# EAGLE design D (EAGLE 8.0.0)
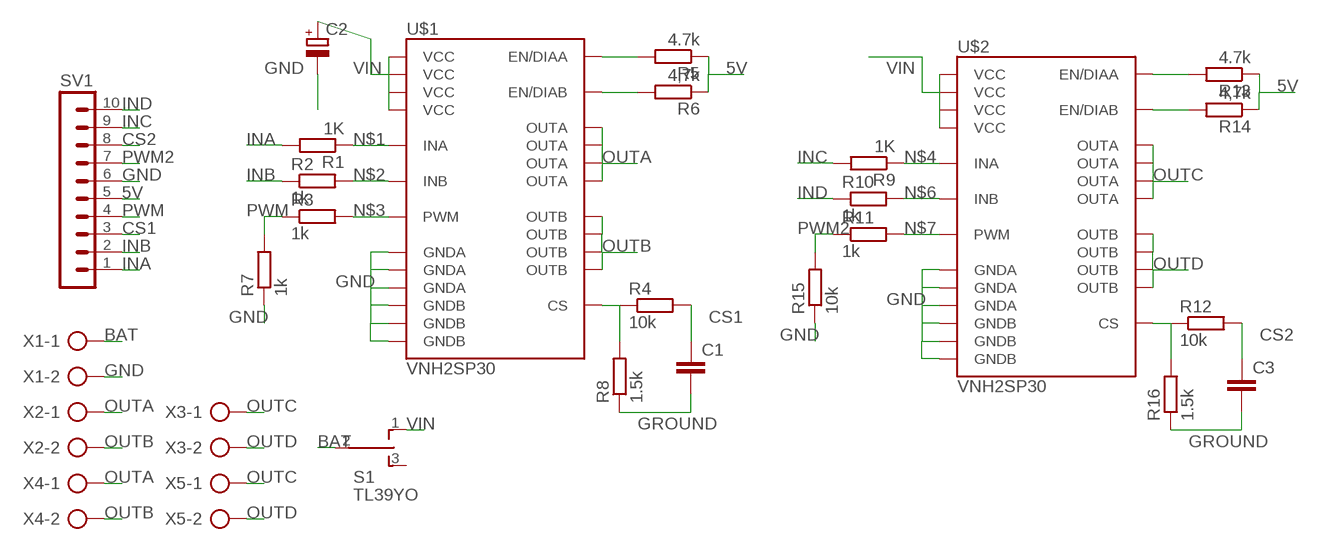
[diagram p0: schematic, sheet 1]

## Parts
C1  CAP1206  [1206]
C2  CPOL-EUE3.5-8  [E3,5-8]
C3  CAP1206  [1206]
R1  1K  R-EU_M1206  [M1206]
R2  1k  R-EU_M1206  [M1206]
R3  1k  R-EU_M1206  [M1206]
R4  10k  R-EU_M1206  [M1206]
R5  4.7k  R-EU_M1206  [M1206]
R6  4,7k  R-EU_M1206  [M1206]
R7  1k  R-EU_M1206  [M1206]
R8  1.5k  R-EU_M1206  [M1206]
R9  1K  R-EU_M1206  [M1206]
R10  1k  R-EU_M1206  [M1206]
R11  1k  R-EU_M1206  [M1206]
R12  10k  R-EU_M1206  [M1206]
R13  4.7k  R-EU_M1206  [M1206]
R14  4,7k  R-EU_M1206  [M1206]
R15  10k  R-EU_M1206  [M1206]
R16  1.5k  R-EU_M1206  [M1206]
S1  TL39YO  [TL3XYO]
SV1  MA10-1W  [MA10-1W]
U$1  VNH2SP30  [VNH2SP30]
U$2  VNH2SP30  [VNH2SP30]
X1  AK300/2  [AK300/2]
X2  AK300/2  [AK300/2]
X3  AK300/2  [AK300/2]
X4  AK300/2  [AK300/2]
X5  AK300/2  [AK300/2]

## Nets
5V: R5.1 R6.1 R13.1 R14.1 SV1.5
BAT: S1.2(P) X1.1
CS1: C1.1 R4.2 SV1.3
CS2: C3.1 R12.2 SV1.8
GND: C2.- R7.1 R15.1 SV1.6 U$1.18(GNDB) U$1.19(GNDB) U$1.20(GNDB) U$1.26(GNDA) U$1.27(GNDA) U$1.28(GNDA) U$2.18(GNDB) U$2.19(GNDB) U$2.20(GNDB) U$2.26(GNDA) U$2.27(GNDA) U$2.28(GNDA) X1.2
GROUND: C1.2 C3.2 R8.1 R16.1
HJ: R12.1 R16.2 U$2.9(CS)
INA: R1.2 SV1.1
INB: R2.1 SV1.2
INC: R9.2 SV1.9
IND: R10.1 SV1.10
N$1: R1.1 U$1.5(INA)
N$2: R2.2 U$1.11(INB)
N$3: R3.2 U$1.8(PWM)
N$4: R9.1 U$2.5(INA)
N$6: R10.2 U$2.11(INB)
N$7: R11.2 U$2.8(PWM)
N$9: R4.1 R8.2 U$1.9(CS)
N$10: R5.2 U$1.6(EN/DIAA)
N$11: R6.2 U$1.10(EN/DIAB)
N$12: R13.2 U$2.6(EN/DIAA)
N$13: R14.2 U$2.10(EN/DIAB)
OUTA: U$1.1(OUTA) U$1.25(OUTA) U$1.30(OUTA) U$1.SLUG3(OUTA) X2.1 X4.1
OUTB: U$1.15(OUTB) U$1.16(OUTB) U$1.21(OUTB) U$1.SLUG2(OUTB) X2.2 X4.2
OUTC: U$2.1(OUTA) U$2.25(OUTA) U$2.30(OUTA) U$2.SLUG3(OUTA) X3.1 X5.1
OUTD: U$2.15(OUTB) U$2.16(OUTB) U$2.21(OUTB) U$2.SLUG2(OUTB) X3.2 X5.2
PWM: R3.1 R7.2 SV1.4
PWM2: R11.1 R15.2 SV1.7
VIN: C2.+ S1.1(O) U$1.3(VCC) U$1.13(VCC) U$1.23(VCC) U$1.SLUG1(VCC) U$2.3(VCC) U$2.13(VCC) U$2.23(VCC) U$2.SLUG1(VCC)
Unconnected: S1.3(S)

## Library data of the parts
C1 C3 = SparkFun:CAP: Capacitor Standard 0603 ceramic capacitor, and 0.1" leaded capacitor.
C2 = rcl:CPOL-EU: POLARIZED CAPACITOR, European symbol
R1-R16 = rcl:R-EU_: RESISTOR, European symbol
S1 = switch:TL39YO: TINY SWITCH ON OFF ON Source: http://www2.produktinfo.conrad.com/datenblaetter/700000-724999/705152-da-01-de-Subminiaturschalter_TL_36YO.pdf
SV1 = con-lstb:MA10-1W: PIN HEADER; OC_FARNELL: unknown; OC_NEWARK: unknown
U$1 U$2 = SparkFun:VNH2SP30
X1-X5 = con-ptr500:AK300/2: CONNECTOR; OC_FARNELL: unknown; OC_NEWARK: unknown

## Board
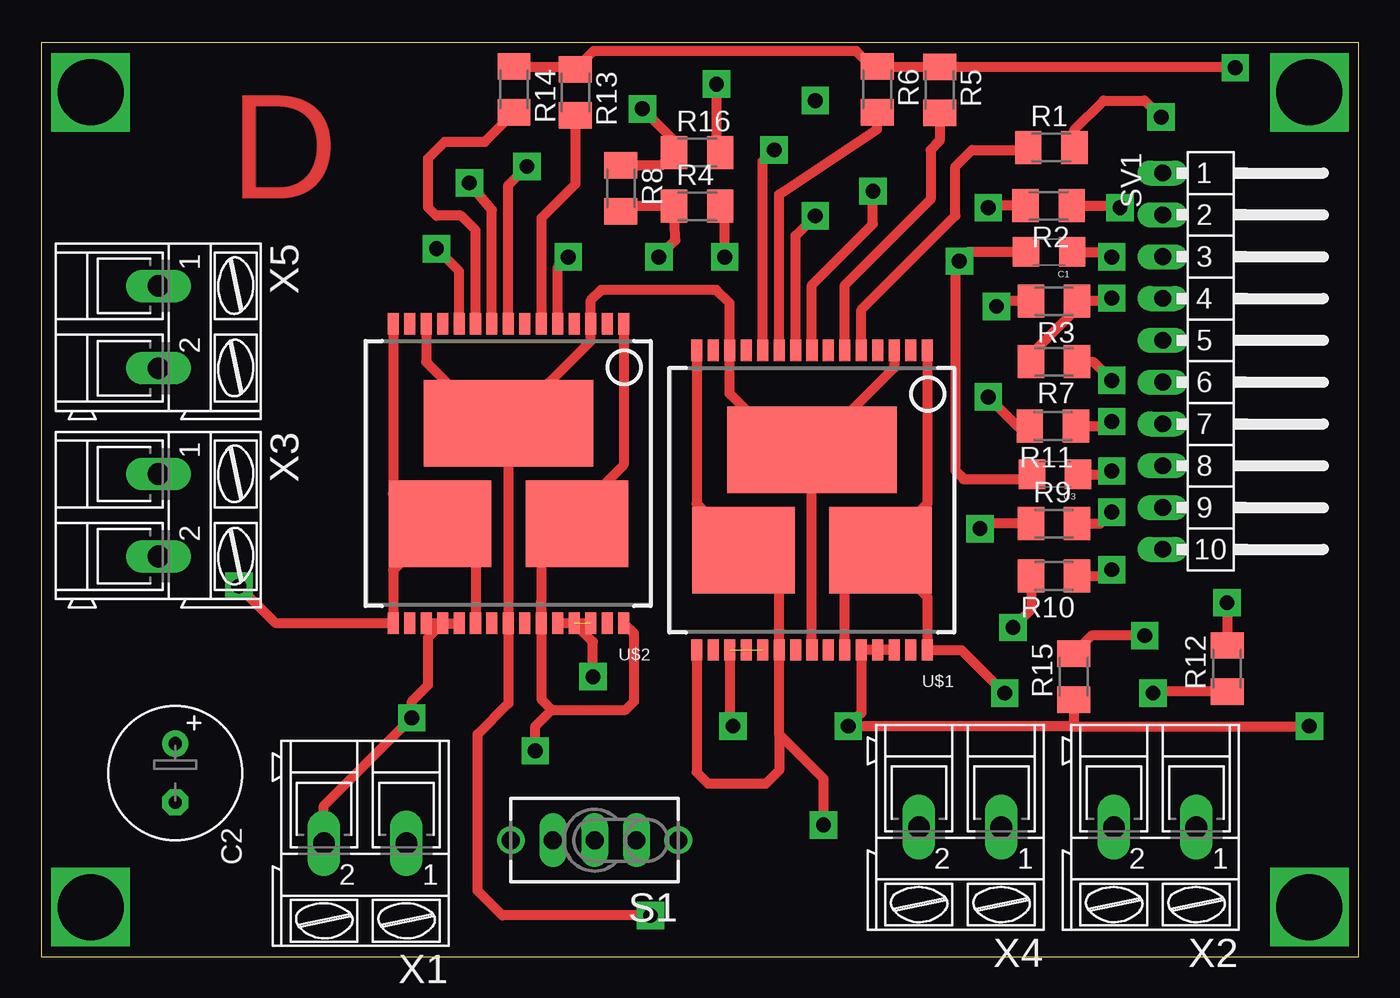
[diagram p1: board, top side]
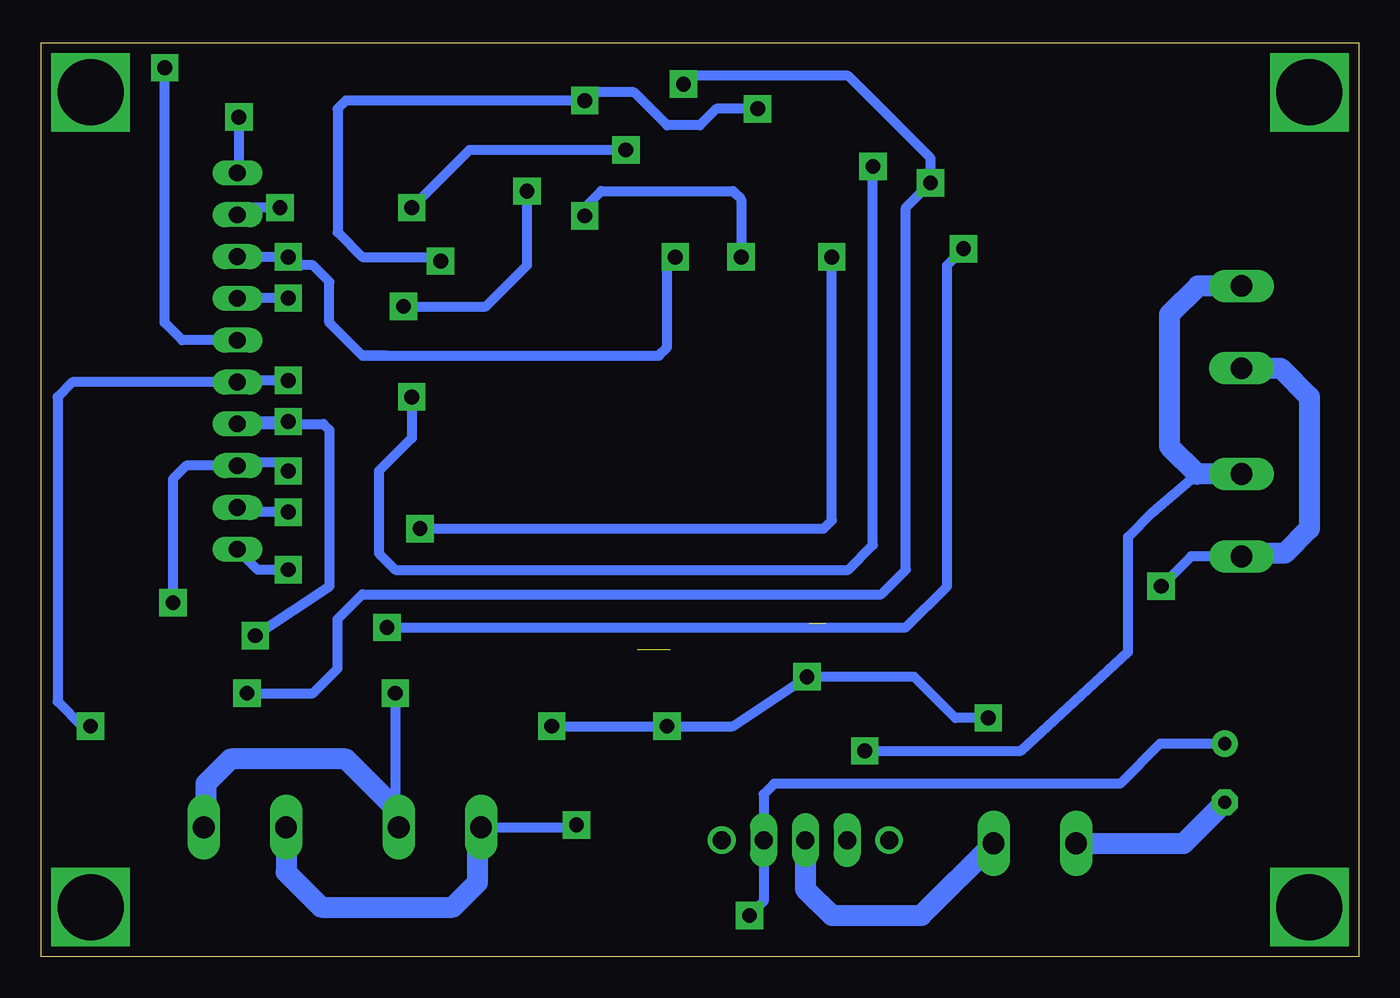
[diagram p2: board, bottom side, seen from below]

Size 80 x 55.5 mm. Coordinates in mm from the lower left corner, seen from the top.
Outline: 0,0 80,0 80,55.5 0,55.5 0,0
Copper layers (1*16): Top 0.035mm / dielectric 1.5mm / Bottom 0.035mm
Design rules "default *": minimum track width 15mil, minimum drill 24mil, track to track 8mil, track to pad 8mil, pad to pad 8mil, via to via 8mil, smd to smd 8mil, copper to edge 40mil, drill to drill 8mil, minimum pad ring 10mil, minimum via ring 15mil, stop-mask expansion 4mil, vias tented up to drill 0mil, thermal gap 10mil

### Footprints (pad centres in the part's own frame; a part is rotated, then mirrored left to right if it is on the bottom)
1206 = smd 1.6 x 1.8: 1 -1.4,0; 2 1.4,0
E3,5-8 = drill 0.813 pad 1.6: + -1.778,0 | drill 0.813 pad 1.6 octagon: - 1.778,0
M1206 = smd 1.6 x 2: 1 -1.4,0; 2 1.4,0
TL3XYO = drill 1.1 pad 1.422 long: 1 -2.54,0; 2 0,0; 3 2.54,0 | drill 1.1 pad 1.676: M1 -5.08,0; M2 5.08,0
MA10-1W = drill 1.016 long: 1 -11.43,0; 2 -8.89,0; 3 -6.35,0; 4 -3.81,0; 5 -1.27,0; 6 1.27,0; 7 3.81,0; 8 6.35,0; 9 8.89,0; 10 11.43,0
VNH2SP30 = smd 0.67 x 1.3: 1 -7,-9.1; 2 -6,-9.1; 3 -5,-9.1; 4 -4,-9.1; 5 -3,-9.1; 6 -2,-9.1; 7 -1,-9.1; 8 0,-9.1; 9 1,-9.1; 10 2,-9.1; 11 3,-9.1; 12 4,-9.1; 13 5,-9.1; 14 6,-9.1; 15 7,-9.1; 16 7,9.1; 17 6,9.1; 18 5,9.1; 19 4,9.1; 20 3,9.1; 21 2,9.1; 22 1,9.1; 23 0,9.1; 24 -1,9.1; 25 -2,9.1; 26 -3,9.1; 27 -4,9.1; 28 -5,9.1; 29 -6,9.1; 30 -7,9.1 | smd 10.3 x 5.25: SLUG1 0,-3.05 | smd 6.23 x 5.25: SLUG2 4.165,3.05; SLUG3 -4.165,3.05
AK300/2 = drill 1.321 long: 1 -2.515,0; 2 2.489,0

### Placement (x,y rotation side)
C1  61.2,42.8 180 top
C2  8.14,11.15 270 top
C3  61.55,29.3 180 top
R1  61.33,49.15 0 top
R2  61.17,45.61 180 top
R3  61.5,39.81 180 top
R4  39.83,45.58 0 top
R5  54.55,52.64 270 top
R6  50.76,52.67 270 top
R7  61.5,36.13 180 top
R8  35.2,46.67 270 top
R9  61.5,26.3 0 top
R10  61.5,23.12 180 top
R11  61.42,32.23 180 top
R12  72,17.5 90 top
R13  32.43,52.5 270 top
R14  28.71,52.67 270 top
R15  62.69,17 90 top
R16  39.83,48.84 0 top
S1  33.6,7.07 180 top
SV1  68.09,36.17 270 top
U$1  46.8,27.73 180 top
U$2  28.37,29.35 180 top
X1  19.66,6.88 180 top
X2  67.62,7.86 180 top
X3  7.12,26.8 270 top
X4  55.78,7.86 180 top
X5  7.12,38.23 270 top

### Tracks (layer width: path | path; a pad name or v marks a point on that pad's centre or on a via)
5V  (via drill 0.9)
  Top 0.61: 50.59,53.9 R6.1 | R6.1 50.79,54.04 R5.1 72.46,54.04 v72.5,54 | R14.1 32.26,54.07 R13.1 33.53,55 49.5,55 50.43,54.07 R6.1
  Bottom 0.61: v72.5,54 72.5,38.5 71.44,37.44 SV1.5
BAT
  Bottom 1.27: S1.2 33.6,4.1 32,2.5 26.55,2.5 X1.1
CS1  (via drill 0.9)
  Top 0.61: C1.1 64.7,42.8 v65,42.5 | v41.5,42.5 41.5,45.31 R4.2
  Bottom 0.61: 68.02,42.52 SV1.3 68.07,42.5 v65,42.5 64.5,42 63.5,42 62.5,41 62.5,38.5 60.5,36.5 | 60.5,36.5 59,36.5 | 59,36.5 42.5,36.5 42,37 42,42 v41.5,42.5 | 59,36.5 60.5,36.5
CS2  (via drill 0.9)
  Top 0.61: C3.1 64.8,29.3 v65,29.5 | v72,21.5 R12.2
  Bottom 0.61: v65,29.5 65.5,30 67.91,30 SV1.8 71.18,29.82 72,29 v72,21.5
GND  (via drill 0.9)  (3 unrouted)
  Top 0.61: U$2.19 U$2.18 | U$2.19 U$2.20 | v33.5,17 33.5,19.12 U$2.27 | U$2.28 U$2.26 | X1.2 17.17,9.17 v22.5,14.5 22.5,15.5 23.5,16.5 23.5,19.38 U$2.19 | U$1.18 41.8,14.8 v42,14 | U$1.28 U$1.27 U$1.26 49.8,14.8 v49,14 62.5,14 | 62.5,14 v77,14 | R15.1 62.69,14.19 62.5,14 | R7.1 63.87,36.13 v65,35
  Bottom 0.61: v22.5,14.5 24.5,14.5 27,17 v33.5,17 38,14 v42,14 v49,14 | v77,14 77.5,14 79,15.5 79,34 78.1,34.9 SV1.6 67.99,35 v65,35
  Bottom 1.27: X1.2 10.63,6.88 C2.-
GROUND  (via drill 0.9)
  Top 0.61: C1.2 56.3,42.8 v55.75,42.25 55.5,42 55.5,29.5 56,29 59.85,29 C3.2 | R8.1 37.66,48.07 R16.1 38.43,49.57 v36.5,51.5
  Bottom 0.61: v55.75,42.25 56,42.5 60.5,42.5 62,44 62,51.5 61.5,52 v47,52 46.5,52.5 44,52.5 42,50.5 40,50.5 39,51.5 v36.5,51.5
HJ  (via drill 0.9)
  Top 0.61: R12.1 67.4,16.1 | 67.4,16.1 67,16.5 | 67.4,16.1 v67.5,16 | v26,47 27.37,45.37 U$2.9 | v41,53 41,49.11 R16.2
  Bottom 0.61: v67.5,16 63.5,16 62,17.5 62,20.5 60.5,22 29,22 27.5,23.5 27.5,45.5 v26,47 26,48.5 31,53.5 41,53.5 v41,53
INA  (via drill 0.9)
  Top 0.61: R1.2 62.73,50.23 64.5,52 67,52 v68,51
  Bottom 0.61: v68,51 68,47.69 SV1.1
INB  (via drill 0.9)
  Top 0.61: R2.1 64.89,45.61 65.5,45 v65.5,45.5
  Bottom 0.61: v65.5,45.5 67.65,45.5 SV1.2
INC  (via drill 0.9)
  Top 0.61: R9.2 64.3,26.3 v65,27
  Bottom 0.61: v65,27 67.81,27 SV1.9
IND  (via drill 0.9)
  Top 0.61: R10.1 64.62,23.12 v65,23.5
  Bottom 0.61: v65,23.5 66.85,23.5 SV1.10
N$1
  Top 0.61: U$1.5 49.8,39.3 55.5,45 55.5,48 56.5,49 59.78,49 R1.1
N$2  (via drill 0.9)
  Top 0.61: R2.2 57.61,45.61 v57.5,45.5 | U$1.11 43.8,48.3 v44.5,49
  Bottom 0.61: v44.5,49 54,49 v57.5,45.5
N$3  (via drill 0.9)
  Top 0.61: R3.2 58.31,39.81 v58,39.5 | v50.5,46.5 50.5,44.5 46.8,40.8 U$1.8
  Bottom 0.61: v58,39.5 53,39.5 50.5,42 v50.5,46.5
N$4  (via drill 0.9)
  Top 0.61: R9.1 57.3,26.3 v57,26 | U$2.5 31.37,41.87 v32,42.5
  Bottom 0.61: v57,26 32.5,26 32,26.5 v32,42.5
N$6  (via drill 0.9)
  Top 0.61: R10.2 60.1,21.1 v59,20 | U$2.11 25.37,41.63 v24,43
  Bottom 0.61: v59,20 27.5,20 25,22.5 25,42 v24,43
N$7  (via drill 0.9)
  Top 0.61: R11.2 59.27,32.23 v57.5,34 | v29.5,48 28.37,46.87 U$2.8
  Bottom 0.61: v57.5,34 57.5,31.5 59.5,29.5 59.5,24.5 58.5,23.5 31,23.5 29.5,25 v29.5,48
N$9  (via drill 0.9)
  Top 0.61: R8.2 35.51,45.58 R4.1 38.5,43.51 v37.5,42.5 | U$1.9 45.8,43.8 v47,45
  Bottom 0.61: 46.5,45 v47,45 47,45.5 46,46.5 38,46.5 37.5,46 v37.5,42.5
N$10
  Top 0.61: U$1.6 48.8,40.8 54,46 54,49 54.55,49.55 R5.2
N$11
  Top 0.61: R6.2 50.76,50.26 44.8,46.3 U$1.10
N$12
  Top 0.61: U$2.6 30.37,44.87 32.43,46.93 R13.2
N$13
  Top 0.61: U$2.10 26.37,44.13 25.5,45 24,45 23.5,45.5 23.5,48.5 24.5,49.5 26.94,49.5 R14.2
N$16  (via drill 4)
  other vias: 3,52.5
N$17  (via drill 4)
  other vias: 3,3
N$18  (via drill 4)
  other vias: 77,3
N$19  (via drill 4)
  other vias: 77,52.5
OUTA  (via drill 0.9)
  Top 0.61: U$1.25 48.8,22.52 U$1.SLUG3 | U$1.SLUG3 53.8,21.84 U$1.30 55.87,18.63 v58.5,16 | U$1.1 53.8,27.52 U$1.SLUG3
  Bottom 0.61: v58.5,16 58.5,8.06 X4.1
  Bottom 1.27: X4.1 58.3,8.79 61.5,12 68.5,12 70,10.5 70,8 X2.1
OUTB  (via drill 0.9)
  Top 0.61: U$1.16 39.8,11.2 40.5,10.5 44,10.5 44.8,11.3 44.8,13.5 | 44.8,13.5 U$1.21 44.8,22.52 U$1.SLUG2 39.8,27.52 U$1.15 | v47.5,8 47.5,10.8 44.8,13.5
  Bottom 0.61: X4.2 47.64,7.86 v47.5,8
  Bottom 1.27: X2.2 65.13,5.13 63,3 55,3 53.5,4.5 53.5,7.65 X4.2
OUTC  (via drill 0.9)
  Top 0.61: U$2.25 30.37,24.14 U$2.SLUG3 32.53,27.04 35.37,29.87 U$2.1 | U$2.25 30.37,21.63 | U$2.25 30.37,15.63 31,15 | 31,15 35.5,15 36,15.5 36,19.62 U$2.30 | v30,12.5 30,14 31,15
  Bottom 0.61: 9.81,29.32 12.5,27 14,25.5 14,18.5 20.5,12.5 v30,12.5
  Bottom 1.27: X3.1 9.81,29.32 11.5,31 11.5,39 9.76,40.74 X5.1
OUTD  (via drill 0.9)
  Top 0.61: U$2.21 26.37,24.14 U$2.SLUG2 23.7,25.8 | 23.7,25.8 21.37,23.46 U$2.16 14.25,20.25 v12,22.5 | U$2.15 21.37,28.13 23.7,25.8
  Bottom 0.61: X3.2 10.19,24.31 v12,22.5
  Bottom 1.27: X5.2 4.74,35.74 3,34 3,26 4.5,24.5 6.93,24.5 X3.2
PWM  (via drill 0.9)
  Top 0.61: v65,40 64.81,39.81 R3.1 62.9,39.4 61.75,38.25 | 60.1,36.6 R7.2 60.1,36.6 | 61.75,38.25 60.1,36.6 | 60.1,36.6 61.75,38.25
  Bottom 0.61: v65,40 68.07,40 SV1.4
PWM2  (via drill 0.9)
  Top 0.61: R11.1 64.73,32.23 v65,32.5 | v67,19.5 63.79,19.5 R15.2
  Bottom 0.61: v65,32.5 67.95,32.5 SV1.7 62.86,32.36 62.5,32 62.5,22.5 v67,19.5
VIN  (via drill 0.9)
  Top 0.61: v37,2.5 28,2.5 26.5,4 26.5,13.5 28.37,15.37 U$2.23 U$2.SLUG1 | U$2.SLUG1 27.1,32.4 23.37,36.13 U$2.13 | U$2.SLUG1 33.37,37.4 U$2.3 33.37,39.87 34,40.5 41,40.5 41.8,39.7 U$1.13 41.8,34.2 45.22,30.78 U$1.SLUG1 | U$1.3 51.8,35.78 U$1.SLUG1 | U$1.23 U$1.SLUG1
  Bottom 0.61: C2.+ 12.07,12.93 14.5,10.5 35.5,10.5 36.14,9.86 S1.1 36.14,3.36 v37,2.5

### Text on the board
Top: D